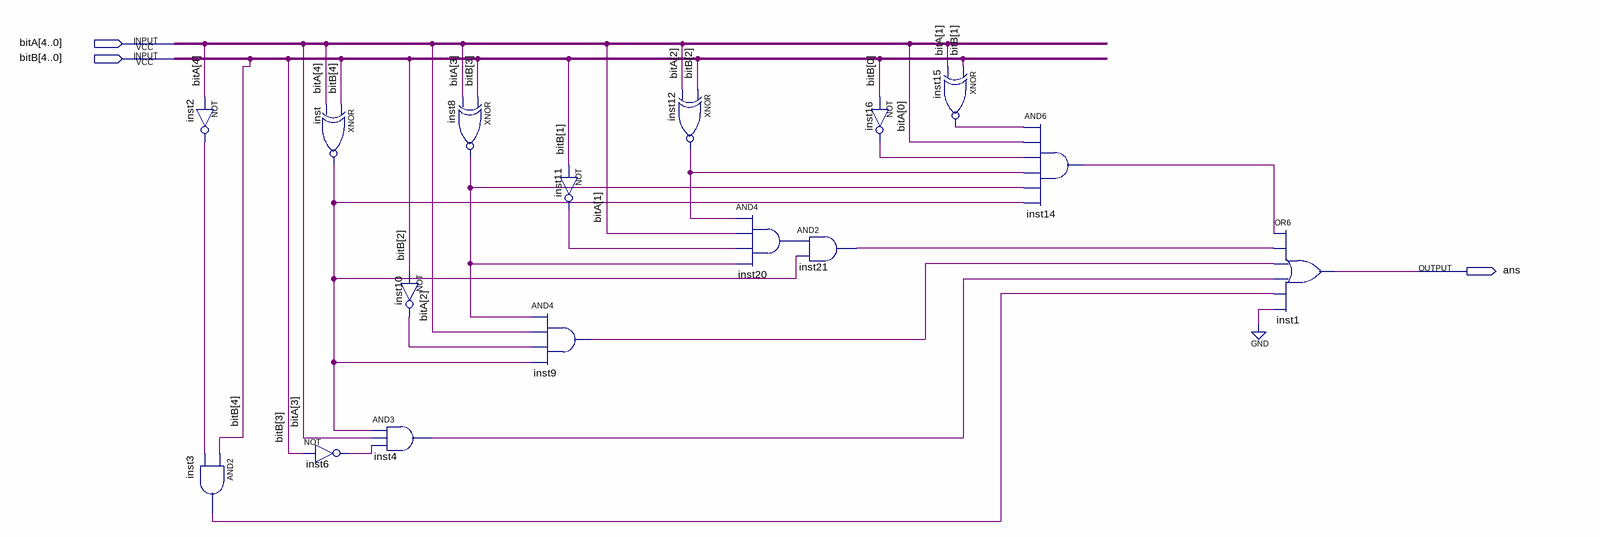
[diagram p0: schematic sheet]
// Quartus schematic comparison_MT.bdf as structural Verilog: 16 symbols, 3 pins
module comparison_MT (
  input  [4:0] bitA,
  input  [4:0] bitB,
  output ans
);

  wire inst2_out, inst3_out, inst4_out, inst6_out, inst8_out, inst9_out, inst10_out, inst11_out, inst12_out,
       inst14_out, inst15_out, inst16_out, inst20_out, inst21_out, inst_out;

  not inst2 (inst2_out, bitA[4]);
  and inst3 (inst3_out, bitB[4], inst2_out);
  xnor inst (inst_out, bitB[4], bitA[4]);
  not inst6 (inst6_out, bitB[3]);
  and inst4 (inst4_out, inst_out, bitA[3], inst6_out);
  xnor inst8 (inst8_out, bitB[3], bitA[3]);
  not inst10 (inst10_out, bitB[2]);
  not inst11 (inst11_out, bitB[1]);
  and inst9 (inst9_out, inst8_out, bitA[2], inst10_out, inst_out);
  xnor inst12 (inst12_out, bitB[2], bitA[2]);
  and inst20 (inst20_out, inst12_out, bitA[1], inst11_out, inst8_out);
  and inst21 (inst21_out, inst20_out, inst_out);
  not inst16 (inst16_out, bitB[0]);
  xnor inst15 (inst15_out, bitB[1], bitA[1]);
  and inst14 (inst14_out, inst15_out, bitA[0], inst16_out, inst12_out, inst8_out, inst_out);
  or inst1 (ans, inst14_out, inst21_out, inst9_out, inst4_out, inst3_out, 1'b0);
endmodule
